# EAGLE design ATSAMD09C Breakout (EAGLE 7.2.0)
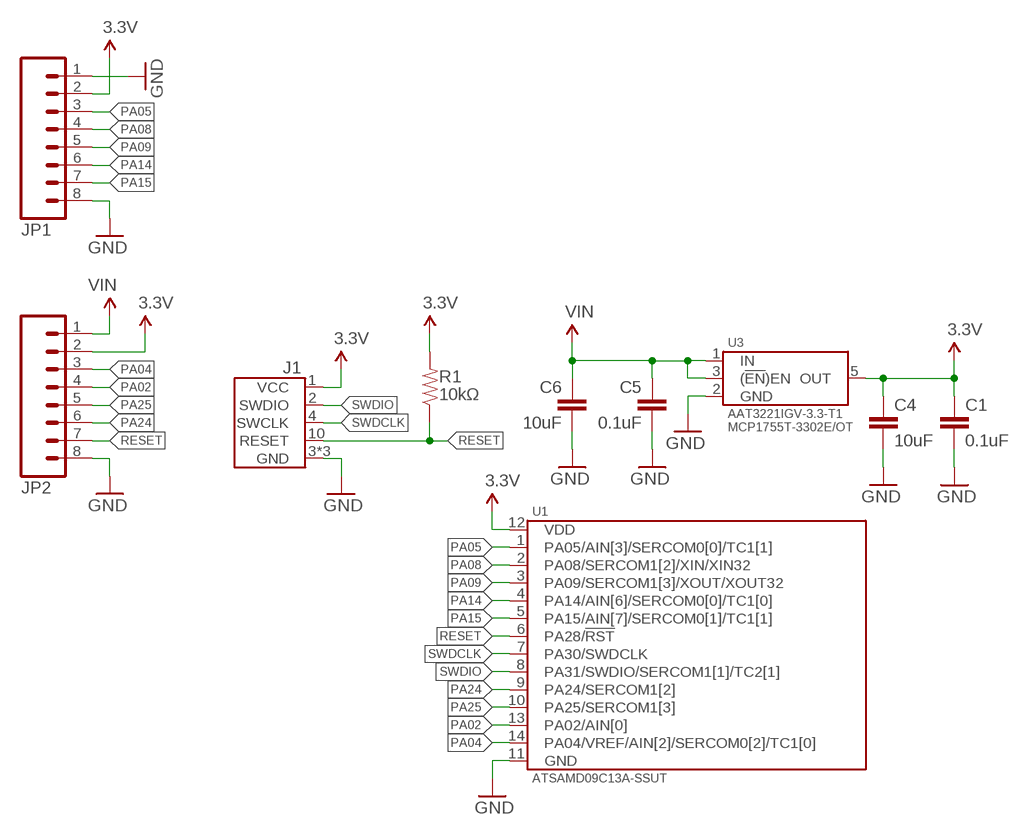
[diagram p0: schematic, sheet 1]

## Parts
C1  0.1uF  CAP-0805  [0805-CAP]
C4  10uF  CAP-0805  [0805-CAP]
C5  0.1uF  CAP-0805  [0805-CAP]
C6  10uF  CAP-0805  [0805-CAP]
J1  SWD-50MIL-SHROUDED  [M05X2_50MIL_SHROUDED]
JP1  M08NO_SILK  [1X08_NO_SILK]
JP2  M08NO_SILK  [1X08_NO_SILK]
R1  10kΩ  RESISTOR-0805  [0805-RES]
U1  ATSAMD09C13A-SSUT  [SOIC-14]
U3  AAT3221IGV-3.3-T1  [SOT23-5]

## Nets
3.3V: C1.1 C4.1 J1.1(VCC) JP1.2 JP2.2 R1.2 U1.12(VDD) U3.5(OUT)
GND: C1.2 C4.2 C5.2 C6.2 J1.3(GND) J1.5(GND) J1.9(GND) JP1.1 JP1.8 JP2.8 U1.11(GND) U3.2(GND)
PA02: JP2.4 U1.13(PA02/AIN[0])
PA04: JP2.3 U1.14(PA04/VREF/AIN[2]/SERCOM0[2]/TC1[0])
PA05: JP1.3 U1.1(PA05/AIN[3]/SERCOM0[0]/TC1[1])
PA08: JP1.4 U1.2(PA08/SERCOM1[2]/XIN/XIN32)
PA09: JP1.5 U1.3(PA09/SERCOM1[3]/XOUT/XOUT32)
PA14: JP1.6 U1.4(PA14/AIN[6]/SERCOM0[0]/TC1[0])
PA15: JP1.7 U1.5(PA15/AIN[7]/SERCOM0[1]/TC1[1])
PA24: JP2.6 U1.9(PA24/SERCOM1[2])
PA25: JP2.5 U1.10(PA25/SERCOM1[3])
RESET: J1.10(RESET) JP2.7 R1.1 U1.6(PA28/!RST)
SWDCLK: J1.4(SWCLK) U1.7(PA30/SWDCLK)
SWDIO: J1.2(SWDIO) U1.8(PA31/SWDIO/SERCOM1[1]/TC2[1])
VIN: C5.1 C6.1 JP2.1 U3.1(IN) U3.3((!EN!)EN)

## Notes on the sheet
- MCP1755T-3302E/OT

## Library data of the parts
C1 C4-C6 = Passives:CAP
J1 = Connectors:SWD
JP1 JP2 = SparkFun-Connectors:M08: Header 8 Standard 8-pin 0.1" header. Use with straight break away headers (SKU : PRT-00116), right angle break away headers (PRT-00553), swiss pins (PRT-00743), machine pins (PRT-00117), and female headers (PRT-00115).
R1 = Passives:RESISTOR
U1 = Atmel:ATSAMD09C
U3 = Skyworks:AAT3221: 150mA 3.3v LDO Regulator

## Board
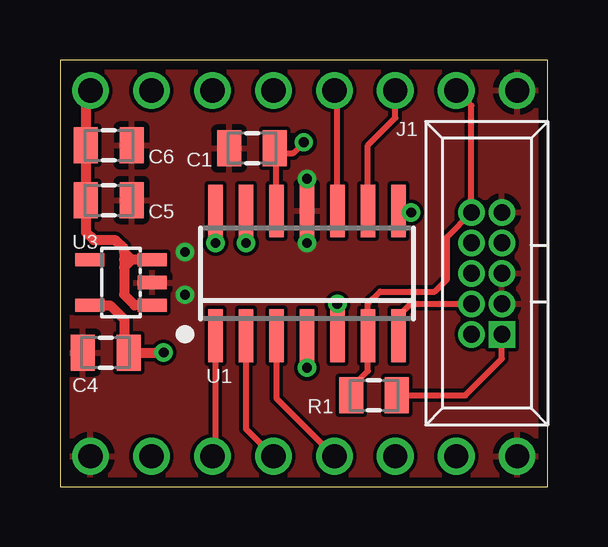
[diagram p1: board, top side]
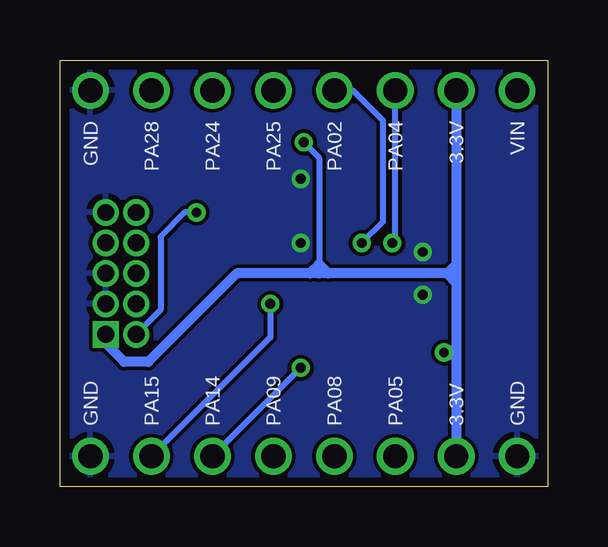
[diagram p2: board, bottom side, seen from below]

Size 20.32 x 17.78 mm. Coordinates in mm from the lower left corner, seen from the top.
Outline: 0,0 20.32,0 20.32,17.78 0,17.78 0,0
Copper layers (1*16): Top 0.0356mm / dielectric 1.5011mm / Bottom 0.0356mm
Design rules "oshpark-2layer *": minimum track width 6mil, minimum drill 13mil, track to track 6mil, track to pad 6mil, pad to pad 6mil, via to via 6mil, smd to smd 6mil, copper to edge 15mil, drill to drill 6mil, minimum pad ring 7mil, minimum via ring 7mil, stop-mask expansion 4mil, vias tented up to drill 20mil, thermal gap 10mil

### Footprints (pad centres in the part's own frame; a part is rotated, then mirrored left to right if it is on the bottom)
0805-CAP = smd 1 x 1.5: 1 -0.95,0; 2 0.95,0
M05X2_50MIL_SHROUDED = drill 0.7 pad 1.1 square: 1 -2.54,-0.635 | drill 0.7 pad 1.1: 2 -2.54,0.635; 3 -1.27,-0.635; 4 -1.27,0.635; 5 0,-0.635; 6 0,0.635; 7 1.27,-0.635; 8 1.27,0.635; 9 2.54,-0.635; 10 2.54,0.635
1X08_NO_SILK = drill 1.016: 1 0,0; 2 2.54,0; 3 5.08,0; 4 7.62,0; 5 10.16,0; 6 12.7,0; 7 15.24,0; 8 17.78,0
0805-RES = smd 1 x 1.5: 1 -0.95,0; 2 0.95,0
SOIC-14 = smd 2.2 x 0.6: 1 -2.6,3.81; 2 -2.6,2.54; 3 -2.6,1.27; 4 -2.6,0; 5 -2.6,-1.27; 6 -2.6,-2.54; 7 -2.6,-3.81; 8 2.6,-3.81; 9 2.6,-2.54; 10 2.6,-1.27; 11 2.6,0; 12 2.6,1.27; 13 2.6,2.54; 14 2.6,3.81
SOT23-5 = smd 1.2 x 0.55: 1 1.3,-0.95; 2 1.3,0; 3 1.3,0.95; 4 -1.3,0.95; 5 -1.3,-0.95

### Placement (x,y rotation side)
C1  8,14.1 180 top
C4  1.91,5.59 180 top
C5  2.03,11.94 0 top
C6  2.03,14.22 0 top
J1  17.78,8.89 90 top
JP1  1.27,1.27 0 top
JP2  1.27,16.51 0 top
R1  13.08,3.81 0 top
U1  10.29,8.89 90 top
U3  2.54,8.51 0 top

### Tracks (layer width: path | path; a pad name or v marks a point on that pad's centre or on a via)
3.3V  (via drill 0.41)
  Top 0.254: R1.2 16.89,3.81 18.41,5.33 J1.1 | U1.12 9.02,13.9 | 9.02,13.9 C1.1 | 9.02,13.9 9.71,13.9 v10.16,14.35
  Top 0.406: U3.5 2.09,7.56 2.67,6.99 2.67,5.78 C4.1 v4.32,5.59
  Bottom 0.254: v10.16,14.35 9.53,13.72 9.53,9.27
  Bottom 0.406: 3.81,8.89 4.19,8.89 | 4.19,8.89 9.14,8.89 | 9.14,8.89 9.53,8.89 | 9.53,8.89 9.91,8.89 | 9.91,8.89 12.95,8.89 16.64,5.21 17.65,5.21 18.41,5.97 J1.1 | JP2.2 3.81,9.27 | 3.81,9.27 3.81,8.89 | 3.81,8.89 3.81,8.51 | 3.81,8.51 3.81,5.84 | 3.81,5.84 3.81,5.59 | 3.81,5.59 3.81,5.33 | 3.81,5.33 JP1.2 | 4.19,8.89 3.81,9.27 | 4.19,8.89 3.81,8.51 | 9.53,9.27 9.53,8.89 | 9.53,9.27 9.14,8.89 | 9.53,9.27 9.91,8.89 | v4.32,5.59 4.06,5.59 | 4.06,5.59 3.81,5.59 | 4.06,5.59 3.81,5.84 | 4.06,5.59 3.81,5.33
GND  (via drill 0.41)
  other vias: 5.21,9.78 10.29,12.83 5.21,8 10.29,10.16
  pour Top: -0.64,18.41 -0.64,-0.64 20.95,-0.64 20.95,18.41
  pour Bottom: -1.27,19.05 -1.27,-1.27 21.59,-1.27 21.59,19.05
PA02  (via drill 0.41)
  Top 0.254: U1.13 v7.75,10.16
  Bottom 0.254: JP2.4 8.13,16.51 6.86,15.24 6.86,11.05 v7.75,10.16
PA04  (via drill 0.41)
  Top 0.254: U1.14 v6.48,10.16
  Bottom 0.254: v6.48,10.16 6.35,10.29 JP2.3
PA05
  Top 0.254: U1.1 6.48,1.4 JP1.3
PA08
  Top 0.254: U1.2 7.75,2.41 JP1.4
PA09
  Top 0.254: U1.3 9.02,3.68 JP1.5
PA14  (via drill 0.41)
  Top 0.254: U1.4 v10.29,4.95
  Bottom 0.254: v10.29,4.95 JP1.6
PA15  (via drill 0.41)
  Top 0.254: U1.5 v11.56,7.62
  Bottom 0.254: v11.56,7.62 11.56,6.22 JP1.7
PA24
  Top 0.254: U1.9 12.83,14.22 13.97,15.37 JP2.6
PA25
  Top 0.254: U1.10 11.56,16.38 JP2.5
RESET
  Top 0.254: R1.1 12.13,4.13 12.83,4.83 U1.6 12.83,7.62 13.34,8.13 15.62,8.13 16.13,8.64 16.13,10.41 J1.10 17.14,15.88 JP2.7
SWDCLK
  Top 0.254: U1.7 14.1,7.11 14.61,7.62 J1.4
SWDIO  (via drill 0.41)
  Top 0.254: U1.8 14.1,11.43 v14.63,11.43
  Bottom 0.254: J1.2 16.13,7.37 16.13,10.41 15.11,11.43 v14.63,11.43
VIN
  Top 0.406: JP2.1 1.08,16.32 C6.1 C5.1 1.08,10.6 1.4,10.29 2.29,10.29 2.67,9.91 2.67,9.78 | 3.56,9.46 U3.3 2.67,9.46 | U3.1 3.11,7.56 2.67,8 2.67,9.14 | 2.67,9.78 2.67,9.46 | 2.67,9.46 2.67,9.14 | 2.67,9.78 2.98,9.46 2.67,9.14

### Text on the board
bPlace: VIN | 3.3V | PA04 | PA02 | PA25 | PA24 | PA28 | GND | GND | 3.3V | PA05 | PA08 | PA09 | PA14 | PA15 | GND